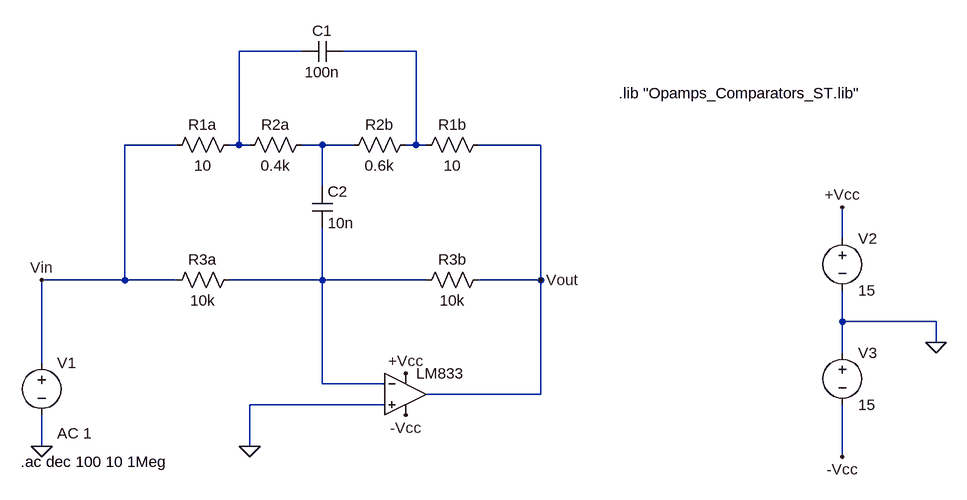
[diagram p0: schematic Con LM833.asc]
Con LM833.asc, the LTspice schematic file:
Version 4
SHEET 1 1076 680
WIRE 80 -352 -16 -352
WIRE 256 -352 144 -352
WIRE -112 -208 -192 -208
WIRE -16 -208 -16 -352
WIRE -16 -208 -32 -208
WIRE 0 -208 -16 -208
WIRE 112 -208 80 -208
WIRE 160 -208 112 -208
WIRE 256 -208 256 -352
WIRE 256 -208 240 -208
WIRE 272 -208 256 -208
WIRE 448 -208 352 -208
WIRE 112 -144 112 -208
WIRE 912 -64 912 -112
WIRE -192 0 -192 -208
WIRE -192 0 -320 0
WIRE -112 0 -192 0
WIRE 112 0 112 -80
WIRE 112 0 -32 0
WIRE 272 0 112 0
WIRE 448 0 448 -208
WIRE 448 0 352 0
WIRE 912 64 912 16
WIRE 1056 64 912 64
WIRE 1056 96 1056 64
WIRE 912 112 912 64
WIRE -320 128 -320 0
WIRE 112 160 112 0
WIRE 208 160 112 160
WIRE 448 176 448 0
WIRE 448 176 272 176
WIRE 208 192 0 192
WIRE -320 256 -320 208
WIRE 0 256 0 192
WIRE 912 272 912 192
FLAG -320 256 0
FLAG 0 256 0
FLAG 1056 96 0
FLAG 912 -112 +Vcc
FLAG 912 272 -Vcc
FLAG 448 0 Vout
FLAG -320 0 Vin
FLAG 240 208 -Vcc
FLAG 240 144 +Vcc
SYMBOL res -16 -16 R90
WINDOW 0 0 56 VBottom 2
WINDOW 3 32 56 VTop 2
SYMATTR InstName R3a
SYMATTR Value 10k
SYMBOL res 368 -16 R90
WINDOW 0 0 56 VBottom 2
WINDOW 3 32 56 VTop 2
SYMATTR InstName R3b
SYMATTR Value 10k
SYMBOL res -16 -224 R90
WINDOW 0 0 56 VBottom 2
WINDOW 3 32 56 VTop 2
SYMATTR InstName R1a
SYMATTR Value 10
SYMBOL res 368 -224 R90
WINDOW 0 0 56 VBottom 2
WINDOW 3 32 56 VTop 2
SYMATTR InstName R1b
SYMATTR Value 10
SYMBOL res 256 -224 R90
WINDOW 0 0 56 VBottom 2
WINDOW 3 32 56 VTop 2
SYMATTR InstName R2b
SYMATTR Value 0.6k
SYMBOL res 96 -224 R90
WINDOW 0 0 56 VBottom 2
WINDOW 3 32 56 VTop 2
SYMATTR InstName R2a
SYMATTR Value 0.4k
SYMBOL cap 96 -144 R0
SYMATTR InstName C2
SYMATTR Value 10n
SYMBOL cap 144 -368 R90
WINDOW 0 0 32 VBottom 2
WINDOW 3 32 32 VTop 2
SYMATTR InstName C1
SYMATTR Value 100n
SYMBOL voltage -320 112 R0
WINDOW 123 24 124 Left 2
WINDOW 39 0 0 Left 0
SYMATTR Value2 AC 1
SYMATTR InstName V1
SYMATTR Value ""
SYMBOL voltage 912 -80 R0
SYMATTR InstName V2
SYMATTR Value 15
SYMBOL voltage 912 96 R0
SYMATTR InstName V3
SYMATTR Value 15
SYMBOL Opamps\\UniversalOpamp2 240 176 R0
SYMATTR InstName LM833
TEXT -352 280 Left 2 !.ac dec 100 10 1Meg
TEXT 568 -288 Left 2 !.lib "Opamps_Comparators_ST.lib"

The netlist it stands for:
* Con LM833.asc
R3a N004 Vin 10k
R3b Vout N004 10k
R1a N001 Vin 10
R1b Vout N002 10
R2b N002 N003 0.6k
R2a N003 N001 0.4k
C2 N003 N004 10n
C1 N002 N001 100n
V1 Vin 0 AC 1
V2 +Vcc 0 15
V3 0 -Vcc 15
XLM833 0 N004 +Vcc -Vcc Vout level.2 Avol=1Meg GBW=10Meg Slew=10Meg ilimit=25m rail=0 Vos=0 phimargin=45 en=0 enk=0 in=0 ink=0 Rin=500Meg  ; pins IN+ IN- V+ V- OUT
.ac dec 100 10 1Meg
.lib "Opamps_Comparators_ST.lib"
.lib UniversalOpamps2.sub
.backanno
.end